# EAGLE design PAGE1 (EAGLE 9.6.0)

## Sheet 1 of 2
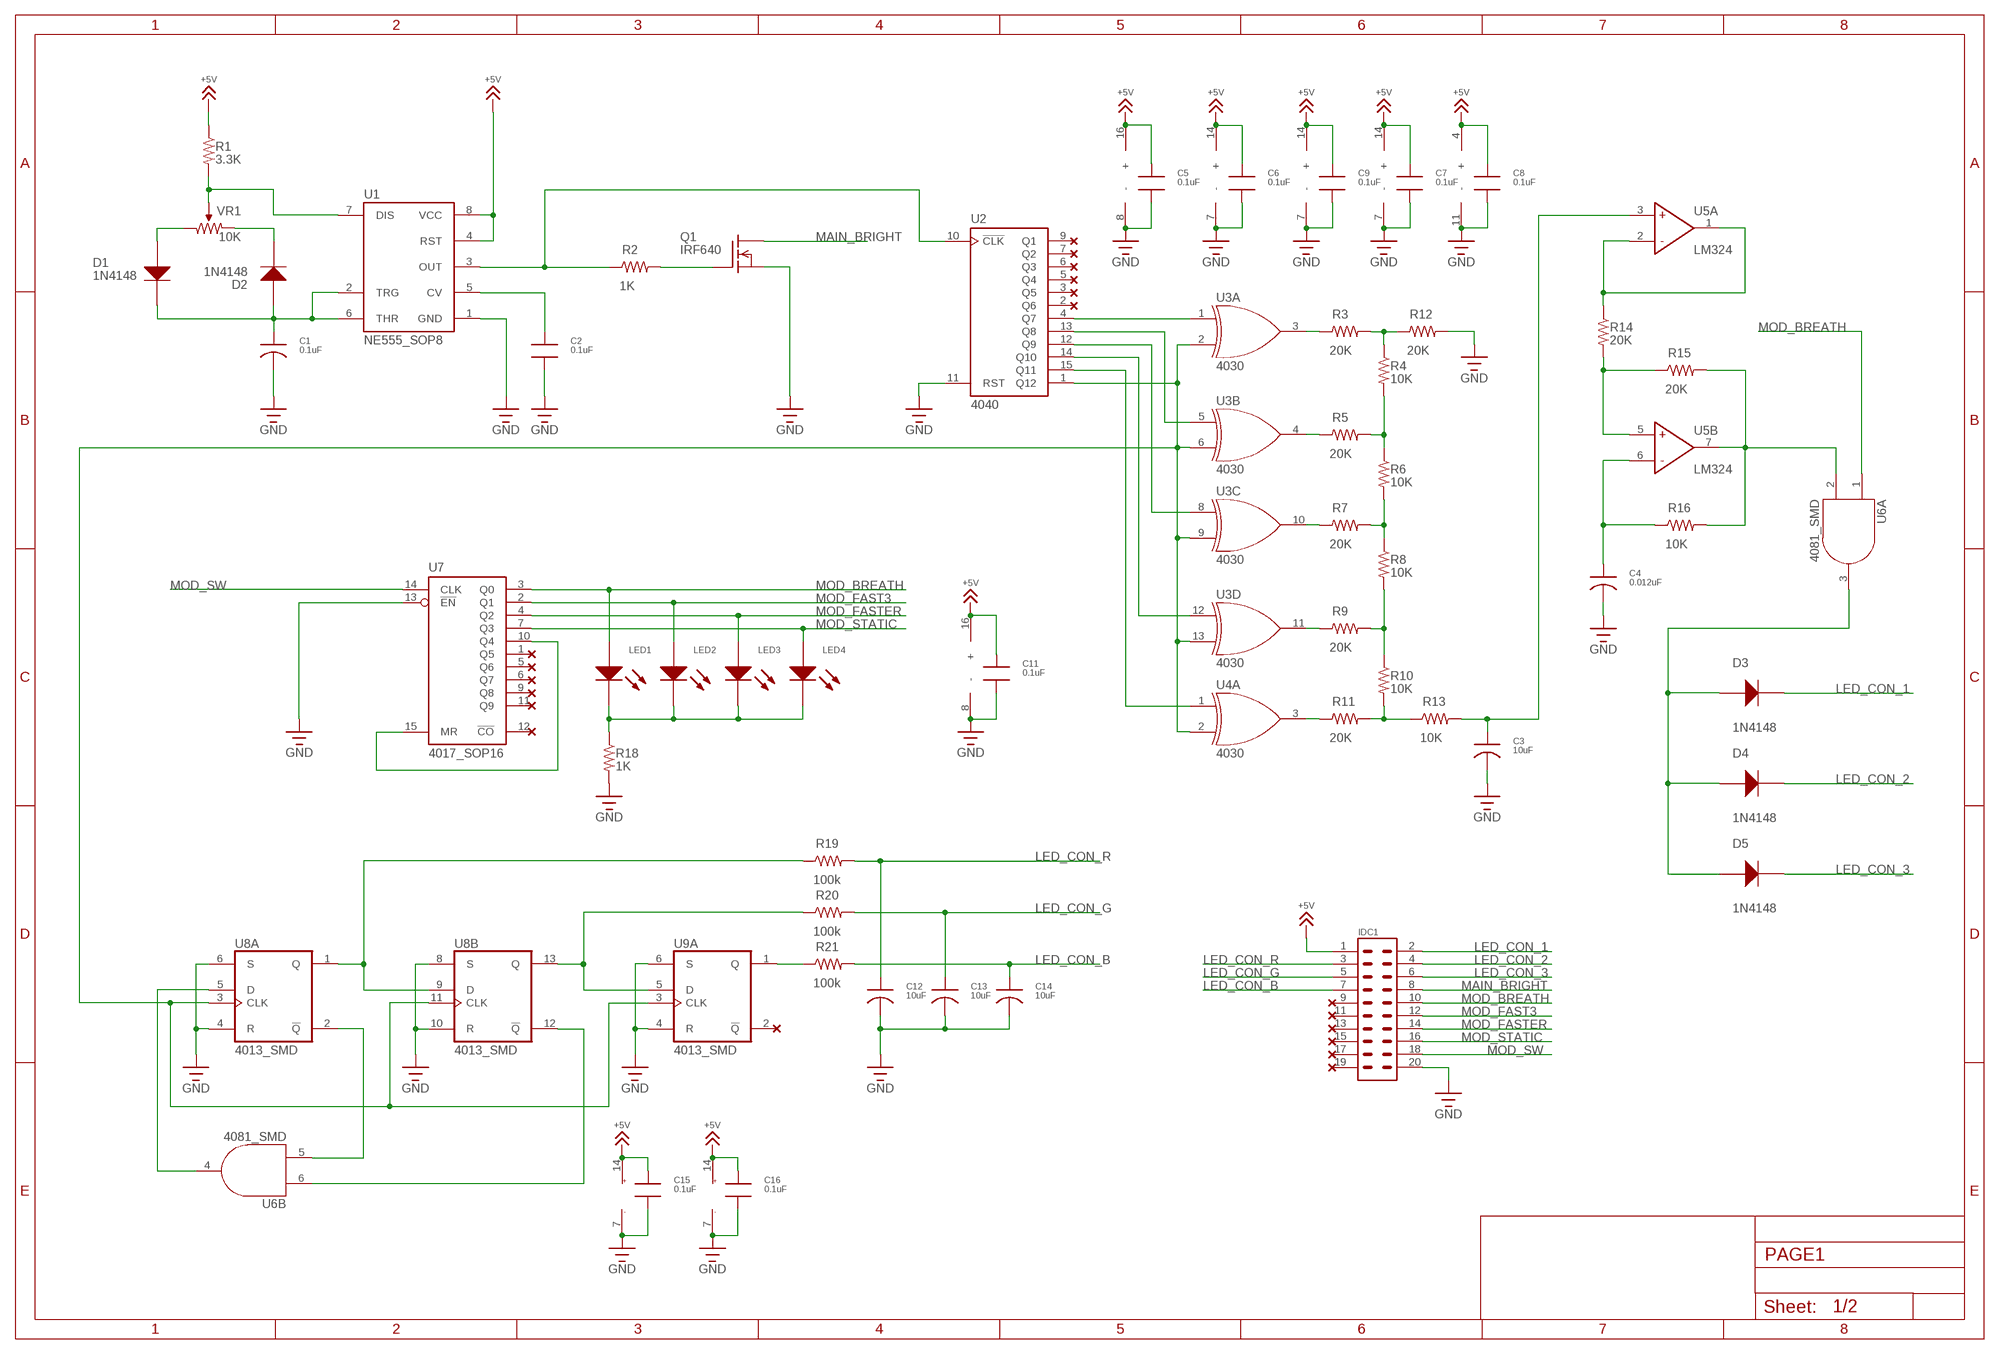
[diagram p0: schematic, sheet 1]

### Parts
C1  0.1uF  CAP_POL_NOR  [CAP_POL]
C2  0.1uF  CAP_NP_SMD2012  [SMD2012]
C3  10uF  CAP_POL_NOR  [CAP_POL]
C4  0.012uF  CAP_POL_NOR  [CAP_POL]
C5  0.1uF  CAP_NP_SMD2012  [SMD2012]
C6  0.1uF  CAP_NP_SMD2012  [SMD2012]
C7  0.1uF  CAP_NP_SMD2012  [SMD2012]
C8  0.1uF  CAP_NP_SMD2012  [SMD2012]
C9  0.1uF  CAP_NP_SMD2012  [SMD2012]
C11  0.1uF  CAP_NP_SMD2012  [SMD2012]
C12  10uF  CAP_POL_NOR  [CAP_POL]
C13  10uF  CAP_POL_NOR  [CAP_POL]
C14  10uF  CAP_POL_NOR  [CAP_POL]
C15  0.1uF  CAP_NP_SMD2012  [SMD2012]
C16  0.1uF  CAP_NP_SMD2012  [SMD2012]
D1  1N4148  DIODE_SMD  [SMD_DIODE]
D2  1N4148  DIODE_SMD  [SMD_DIODE]
D3  1N4148  DIODE_SMD  [SMD_DIODE]
D4  1N4148  DIODE_SMD  [SMD_DIODE]
D5  1N4148  DIODE_SMD  [SMD_DIODE]
IDC1  IDC20_BEN  [IDC20_BENDING]
LED1  LED_BEN  [LED_5MM_BEN]
LED2  LED_BEN  [LED_5MM_BEN]
LED3  LED_BEN  [LED_5MM_BEN]
LED4  LED_BEN  [LED_5MM_BEN]
Q1  IRF640  IRF620  [TO220]
R1  3.3K  RES_2012  [SMD2012]
R2  1K  RES_2012  [SMD2012]
R3  20K  RES_2012  [SMD2012]
R4  10K  RES_2012  [SMD2012]
R5  20K  RES_2012  [SMD2012]
R6  10K  RES_2012  [SMD2012]
R7  20K  RES_2012  [SMD2012]
R8  10K  RES_2012  [SMD2012]
R9  20K  RES_2012  [SMD2012]
R10  10K  RES_2012  [SMD2012]
R11  20K  RES_2012  [SMD2012]
R12  20K  RES_2012  [SMD2012]
R13  10K  RES_2012  [SMD2012]
R14  20K  RES_2012  [SMD2012]
R15  20K  RES_2012  [SMD2012]
R16  10K  RES_2012  [SMD2012]
R18  1K  RES_2012  [SMD2012]
R19  100k  RES_2012  [SMD2012]
R20  100k  RES_2012  [SMD2012]
R21  100k  RES_2012  [SMD2012]
U1  NE555_SOP8  [SOP8]
U2  4040  [DIP16]
U3  4030  [DIP14]
U4  4030  [DIP14]
U5  LM324  [DIP14]
U6  4081_SMD  [SOP14]
U7  4017_SOP16  [SOP16]
U8  4013_SMD  [SOIC_14]
U9  4013_SMD  [SOIC_14]
VR1  10K  VR_BIG  [3RP/1610N]

### Nets
+5V [POWER]: C5.1 C6.1 C7.1 C8.1 C9.1 C11.1 C15.1 C16.1 IDC1.1 R1.1 U1.4(RST) U1.8(VCC) U2.16(+) U3.14(+) U4.14(+) U5.4(+) U6.14(+) U7.16(+) U8.14(VCC) U9.14(VCC) ; also sheet 2
GND [POWER]: C1.2 C2.2 C3.2 C4.2 C5.2 C6.2 C7.2 C8.2 C9.2 C11.2 C12.2 C13.2 C14.2 C15.2 C16.2 IDC1.20 Q1.3(S) R12.2 R18.2 U1.1(GND) U2.8(-) U2.11(RST) U3.7(-) U4.7(-) U5.11(-) U6.7(-) U7.8(-) U7.13(!EN) U8.4(A:R) U8.6(A:S) U8.7(GND) U8.8(B:S) U8.10(B:R) U9.4(A:R) U9.6(A:S) U9.7(GND) ; also sheet 2
LED_CON_1: D3.2 IDC1.2 ; also sheet 2
LED_CON_2: D4.2 IDC1.4 ; also sheet 2
LED_CON_3: D5.2 IDC1.6 ; also sheet 2
LED_CON_B: C14.1 IDC1.7 R21.2
LED_CON_G: C13.1 IDC1.5 R20.2
LED_CON_R: C12.1 IDC1.3 R19.2
MAIN_BRIGHT: IDC1.8 Q1.2(D)
MOD_BREATH: IDC1.10 LED1.1 U6.1 U7.3(Q0)
MOD_FAST3: IDC1.12 LED2.1 U7.2(Q1) ; also sheet 2
MOD_FASTER: IDC1.14 LED3.1 U7.4(Q2) ; also sheet 2
MOD_STATIC: IDC1.16 LED4.1 U7.7(Q3) ; also sheet 2
MOD_SW: IDC1.18 U7.14(CLK)
N$1: D1.1 VR1.1
N$2: R1.2 U1.7(DIS) VR1.2
N$3: D2.2 VR1.3
N$4: C2.1 U1.5(CV)
N$5: C1.1 D1.2 D2.1 U1.2(TRG) U1.6(THR)
N$6: R2.1 U1.3(OUT) U2.10(!CLK)
N$7: Q1.1(G) R2.2
N$8: U2.4(Q7) U3.1(A:IN1)
N$9: U2.13(Q8) U3.5(B:IN1)
N$10: U2.12(Q9) U3.8(C:IN1)
N$11: U2.14(Q10) U3.12(D:IN1)
N$12: U2.15(Q11) U4.1(A:IN1)
N$14: R3.1 U3.3(A:OUT)
N$15: R5.1 U3.4(B:OUT)
N$16: R7.1 U3.10(C:OUT)
N$17: R9.1 U3.11(D:OUT)
N$18: R11.1 U4.3(A:OUT)
N$19: R3.2 R4.1 R12.1
N$20: R4.2 R5.2 R6.1
N$21: R6.2 R7.2 R8.1
N$22: R8.2 R9.2 R10.1
N$23: R10.2 R11.2 R13.1
N$24: C3.1 R13.2 U5.3(A:+)
N$25: R14.1 U5.1(A:OUT) U5.2(A:-)
N$26: R15.2 R16.2 U5.7(B:OUT) U6.2
N$27: R14.2 R15.1 U5.5(B:+)
N$28: C4.1 R16.1 U5.6(B:-)
N$29: D3.1 D4.1 D5.1 U6.3
N$32: U7.10(Q4) U7.15(MR)
N$33: LED1.2 LED2.2 LED3.2 LED4.2 R18.1
N$34: U6.5 U8.2(A:!Q)
N$35: U6.6 U8.12(B:!Q)
N$36: U6.4 U8.5(A:D)
N$37: R19.1 U8.1(A:Q) U8.9(B:D)
N$38: R20.1 U8.13(B:Q) U9.5(A:D)
N$39: U2.1(Q12) U3.2(A:IN2) U3.6(B:IN2) U3.9(C:IN2) U3.13(D:IN2) U4.2(A:IN2) U8.3(A:CLK) U8.11(B:CLK) U9.3(A:CLK)
N$40: R21.1 U9.1(A:Q)
Unconnected: IDC1.9 IDC1.11 IDC1.13 IDC1.15 IDC1.17 IDC1.19 U2.2(Q6) U2.3(Q5) U2.5(Q4) U2.6(Q3) U2.7(Q2) U2.9(Q1) U4.4(B:OUT) U4.5(B:IN1) U4.6(B:IN2) U4.8(C:IN1) U4.9(C:IN2) U4.10(C:OUT) U4.11(D:OUT) U4.12(D:IN1) U4.13(D:IN2) U5.8(C:OUT) U5.9(C:-) U5.10(C:+) U5.12(D:+) U5.13(D:-) U5.14(D:OUT) U6.8 U6.9 U6.10 U6.11 U6.12 U6.13 U7.1(Q5) U7.5(Q6) U7.6(Q7) U7.9(Q8) U7.11(Q9) U7.12(!CO) U9.2(A:!Q) U9.8(B:S) U9.9(B:D) U9.10(B:R) U9.11(B:CLK) U9.12(B:!Q) U9.13(B:Q)

## Sheet 2 of 2
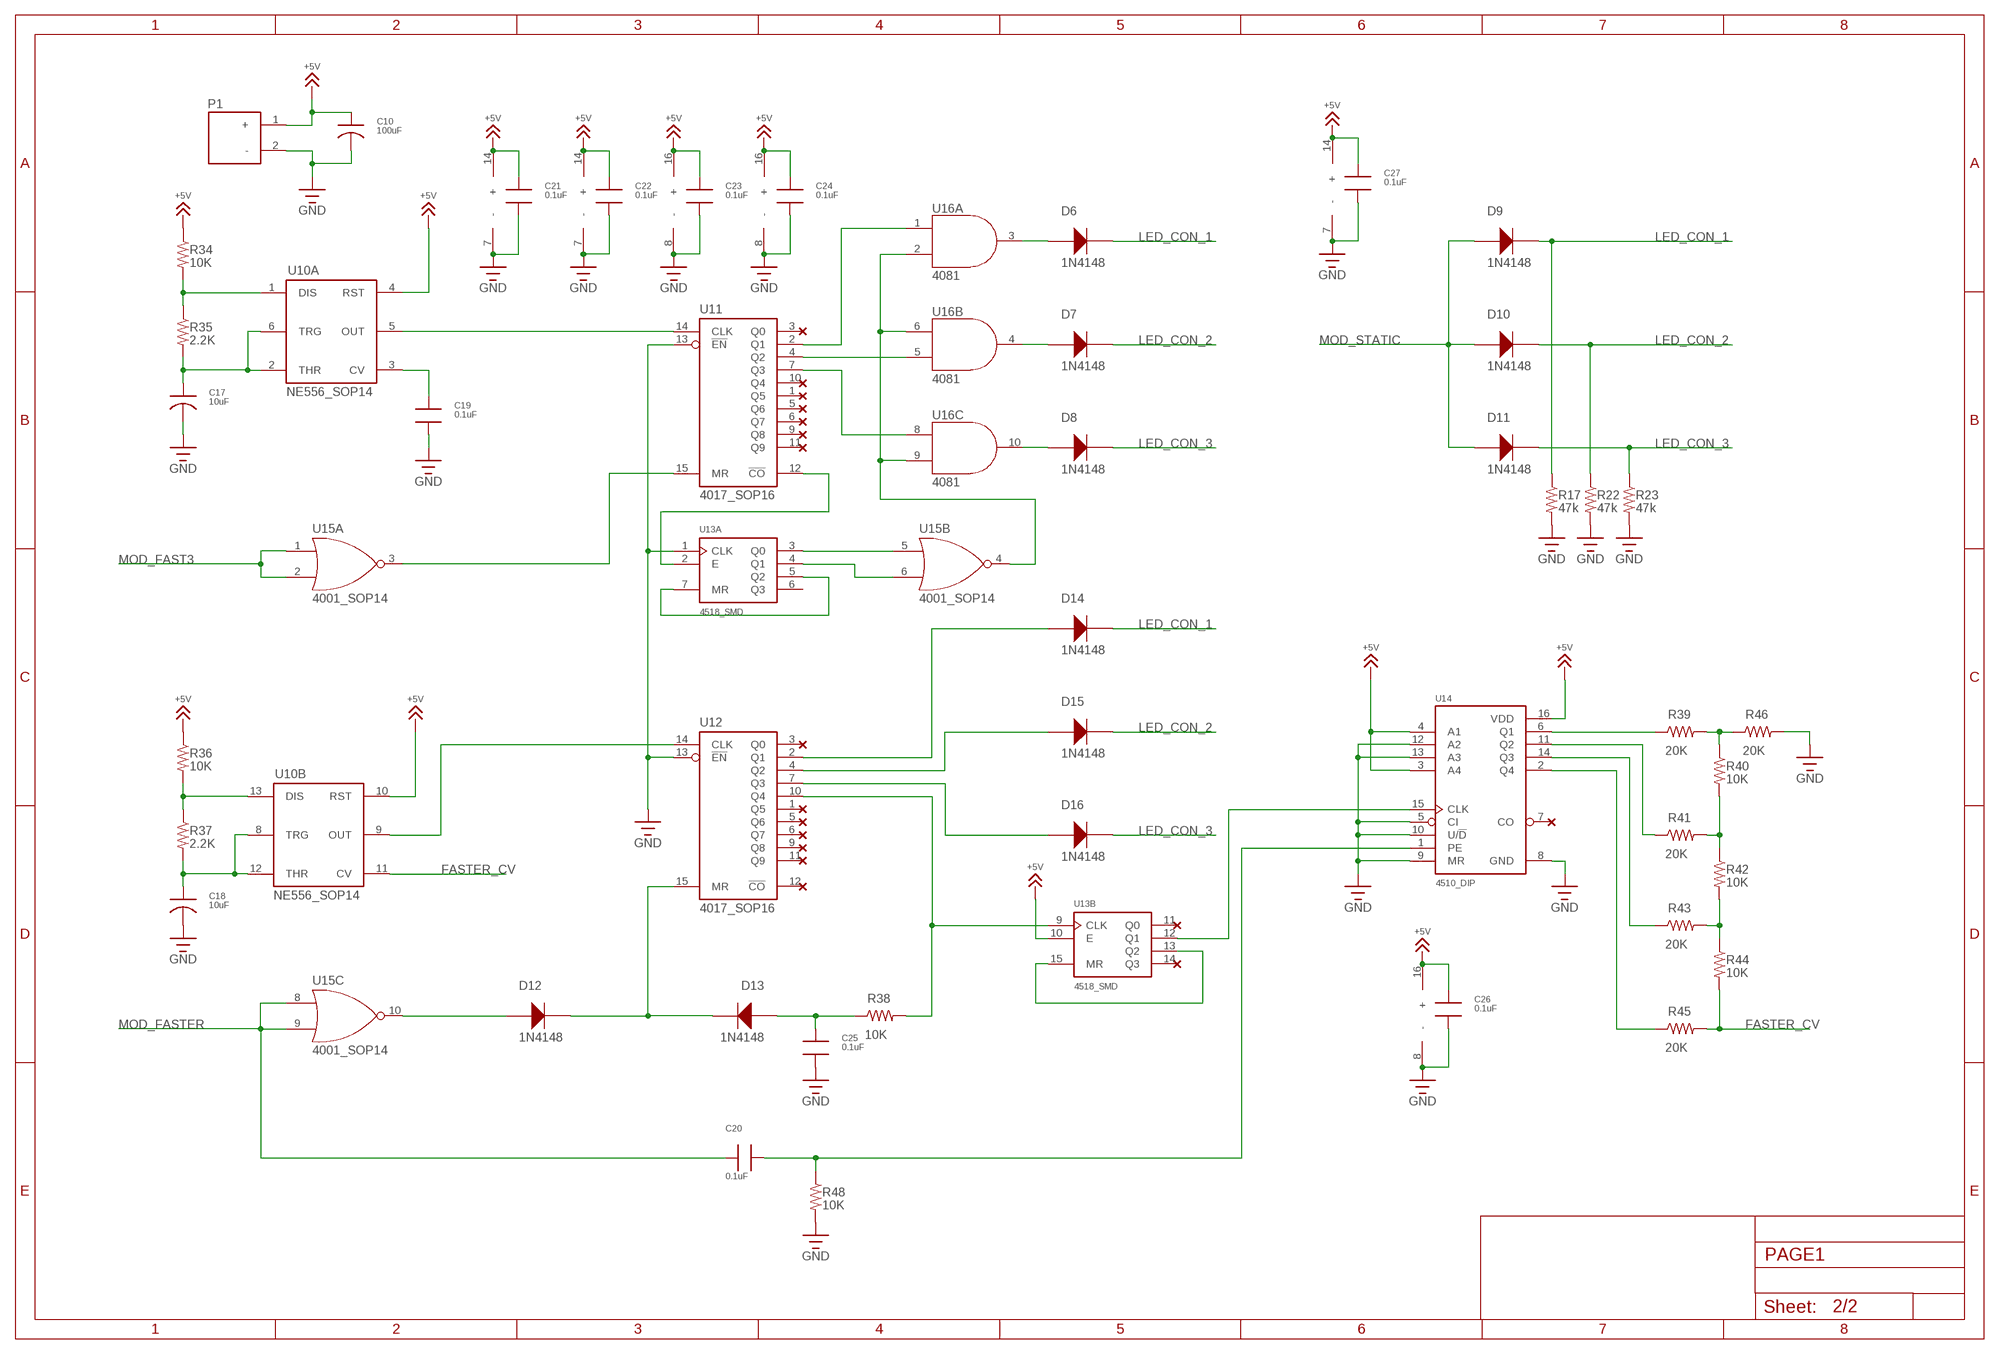
[diagram p1: schematic, sheet 2]

### Parts
C10  100uF  CAP_POL_BIG  [CAP_POL_BIG]
C17  10uF  CAP_POL_NOR  [CAP_POL]
C18  10uF  CAP_POL_NOR  [CAP_POL]
C19  0.1uF  CAP_NP_SMD2012  [SMD2012]
C20  0.1uF  CAP_NP_SMD2012  [SMD2012]
C21  0.1uF  CAP_NP_SMD2012  [SMD2012]
C22  0.1uF  CAP_NP_SMD2012  [SMD2012]
C23  0.1uF  CAP_NP_SMD2012  [SMD2012]
C24  0.1uF  CAP_NP_SMD2012  [SMD2012]
C25  0.1uF  CAP_NP_SMD2012  [SMD2012]
C26  0.1uF  CAP_NP_SMD2012  [SMD2012]
C27  0.1uF  CAP_NP_SMD2012  [SMD2012]
D6  1N4148  DIODE_SMD  [SMD_DIODE]
D7  1N4148  DIODE_SMD  [SMD_DIODE]
D8  1N4148  DIODE_SMD  [SMD_DIODE]
D9  1N4148  DIODE_SMD  [SMD_DIODE]
D10  1N4148  DIODE_SMD  [SMD_DIODE]
D11  1N4148  DIODE_SMD  [SMD_DIODE]
D12  1N4148  DIODE_SMD  [SMD_DIODE]
D13  1N4148  DIODE_SMD  [SMD_DIODE]
D14  1N4148  DIODE_SMD  [SMD_DIODE]
D15  1N4148  DIODE_SMD  [SMD_DIODE]
D16  1N4148  DIODE_SMD  [SMD_DIODE]
P1  POWER_2  [POWER_2]
R17  47k  RES_2012  [SMD2012]
R22  47k  RES_2012  [SMD2012]
R23  47k  RES_2012  [SMD2012]
R34  10K  RES_2012  [SMD2012]
R35  2.2K  RES_2012  [SMD2012]
R36  10K  RES_2012  [SMD2012]
R37  2.2K  RES_2012  [SMD2012]
R38  10K  RES_2012  [SMD2012]
R39  20K  RES_2012  [SMD2012]
R40  10K  RES_2012  [SMD2012]
R41  20K  RES_2012  [SMD2012]
R42  10K  RES_2012  [SMD2012]
R43  20K  RES_2012  [SMD2012]
R44  10K  RES_2012  [SMD2012]
R45  20K  RES_2012  [SMD2012]
R46  20K  RES_2012  [SMD2012]
R48  10K  RES_2012  [SMD2012]
U10  NE556_SOP14  [SOP14]
U11  4017_SOP16  [SOP16]
U12  4017_SOP16  [SOP16]
U13  4518_SMD  [SOP16]
U14  4510_DIP  [DIP16]
U15  4001_SOP14  [SOP14]
U16  4081  [DIP14]

### Nets
+5V [POWER]: C10.1 C21.1 C22.1 C23.1 C24.1 C26.1 C27.1 P1.1(+) R34.1 R36.1 U10.4(A:RST) U10.10(B:RST) U10.14(+) U11.16(+) U12.16(+) U13.10(B:E) U13.16(+) U14.3(A4) U14.4(A1) U14.16(VDD) U15.14(+) U16.14(+) ; also sheet 1
FASTER_CV: R44.2 R45.2 U10.11(B:CV)
GND [POWER]: C10.2 C17.2 C18.2 C19.2 C21.2 C22.2 C23.2 C24.2 C25.2 C26.2 C27.2 P1.2(-) R17.2 R22.2 R23.2 R46.2 R48.2 U10.7(-) U11.8(-) U11.13(!EN) U12.8(-) U12.13(!EN) U13.1(A:CLK) U13.8(-) U14.5(CI) U14.8(GND) U14.9(MR) U14.10(U/!D) U14.12(A2) U14.13(A3) U15.7(-) U16.7(-) ; also sheet 1
LED_CON_1: D6.2 D9.2 D14.2 R17.1 ; also sheet 1
LED_CON_2: D7.2 D10.2 D15.2 R22.1 ; also sheet 1
LED_CON_3: D8.2 D11.2 D16.2 R23.1 ; also sheet 1
MOD_FAST3: U15.1(A:IN1) U15.2(A:IN2) ; also sheet 1
MOD_FASTER: C20.1 U15.8(C:IN1) U15.9(C:IN2) ; also sheet 1
MOD_STATIC: D9.1 D10.1 D11.1 ; also sheet 1
N$58: C17.1 R35.2 U10.2(A:THR) U10.6(A:TRG)
N$59: R34.2 R35.1 U10.1(A:DIS)
N$60: U10.5(A:OUT) U11.14(CLK)
N$61: C19.1 U10.3(A:CV)
N$62: U13.5(A:Q2) U13.7(A:MR)
N$63: U11.12(!CO) U13.2(A:E)
N$64: U11.15(MR) U15.3(A:OUT)
N$65: U13.3(A:Q0) U15.5(B:IN1)
N$66: U13.4(A:Q1) U15.6(B:IN2)
N$67: U11.2(Q1) U16.1
N$68: U11.4(Q2) U16.5
N$69: U11.7(Q3) U16.8
N$70: U15.4(B:OUT) U16.2 U16.6 U16.9
N$71: D6.1 U16.3
N$72: D7.1 U16.4
N$73: D8.1 U16.10
N$74: R36.2 R37.1 U10.13(B:DIS)
N$75: C18.1 R37.2 U10.8(B:TRG) U10.12(B:THR)
N$76: C20.2 R48.1 U14.1(PE)
N$77: U10.9(B:OUT) U12.14(CLK)
N$78: D12.2 D13.2 U12.15(MR)
N$79: R39.1 U14.6(Q1)
N$80: D12.1 U15.10(C:OUT)
N$81: D14.1 U12.2(Q1)
N$82: D15.1 U12.4(Q2)
N$83: D16.1 U12.7(Q3)
N$84: C25.1 D13.1 R38.1
N$85: U13.13(B:Q2) U13.15(B:MR)
N$86: R38.2 U12.10(Q4) U13.9(B:CLK)
N$87: R41.1 U14.11(Q2)
N$88: R43.1 U14.14(Q3)
N$89: U13.12(B:Q1) U14.15(CLK)
N$90: R45.1 U14.2(Q4)
N$91: R39.2 R40.1 R46.1
N$92: R40.2 R41.2 R42.1
N$93: R42.2 R43.2 R44.1
Unconnected: U11.1(Q5) U11.3(Q0) U11.5(Q6) U11.6(Q7) U11.9(Q8) U11.10(Q4) U11.11(Q9) U12.1(Q5) U12.3(Q0) U12.5(Q6) U12.6(Q7) U12.9(Q8) U12.11(Q9) U12.12(!CO) U13.6(A:Q3) U13.11(B:Q0) U13.14(B:Q3) U14.7(CO) U15.11(D:OUT) U15.12(D:IN1) U15.13(D:IN2) U16.11 U16.12 U16.13

## Library data of the parts
C1 C3 C4 C10 C12-C14 C17 C18 = !JKS:CAP_POL
C2 C5-C9 C11 C15 C16 C19-C27 = !JKS:CAP_NP
D1-D16 = !JKS:DIODE
IDC1 = !JKS:IDC20
LED1-LED4 = !JKS:LED
P1 = !JKS:POWER_2
Q1 = transistor-fet:IRF620: N-Channel Enhancement MOSFET (HEXFET); 200V; 5,2A; 0,8Ohm
R1-R23 R34-R46 R48 = !JKS:RES
U1 = !JKS:NE555
U2 = !JKS:4040
U3 U4 = !JKS:4030
U5 = !JKS:LM324
U6 U16 = !JKS:4081
U7 U11 U12 = !JKS:4017
U8 U9 = !SEM_03:4013: Dual D-Type Flip-Flop
U10 = !JKS:NE556
U13 = !JKS:4518
U14 = !JKS:4510
U15 = !JKS:4001
VR1 = !JKS:VR

## Net classes
0 default: width 0.254 mm
1 POWER: width 0.3 mm

## Board
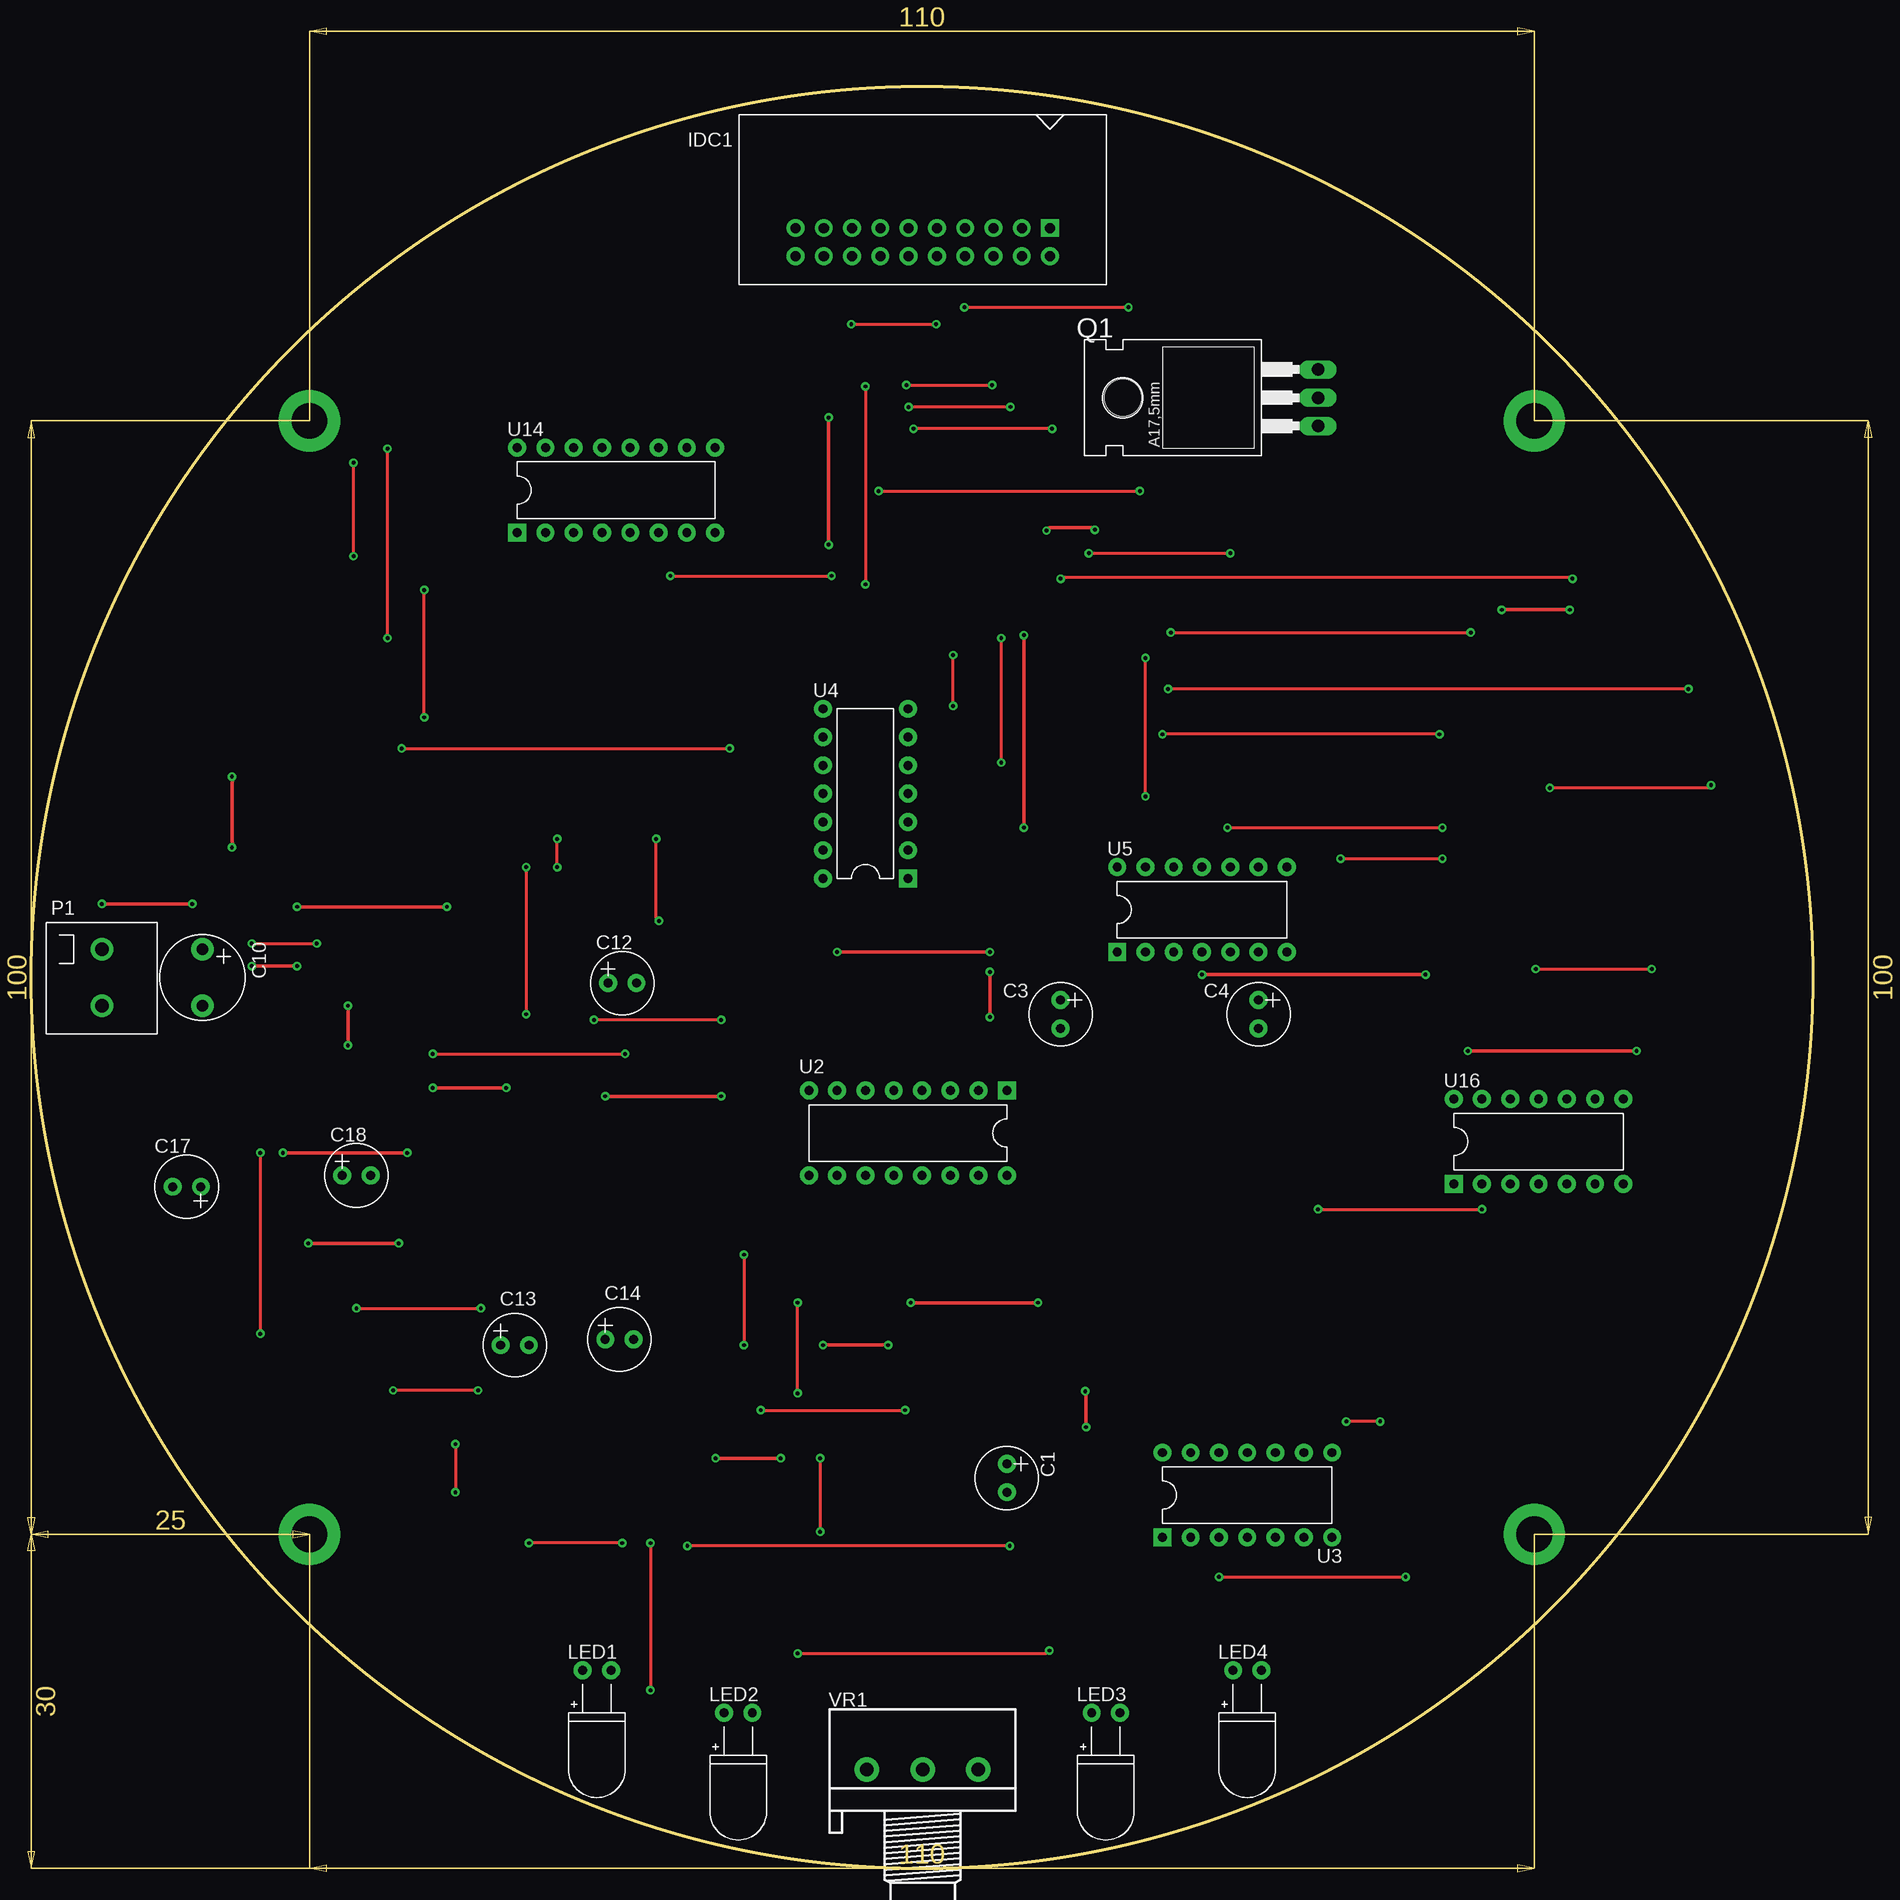
[diagram p2: board, top side]
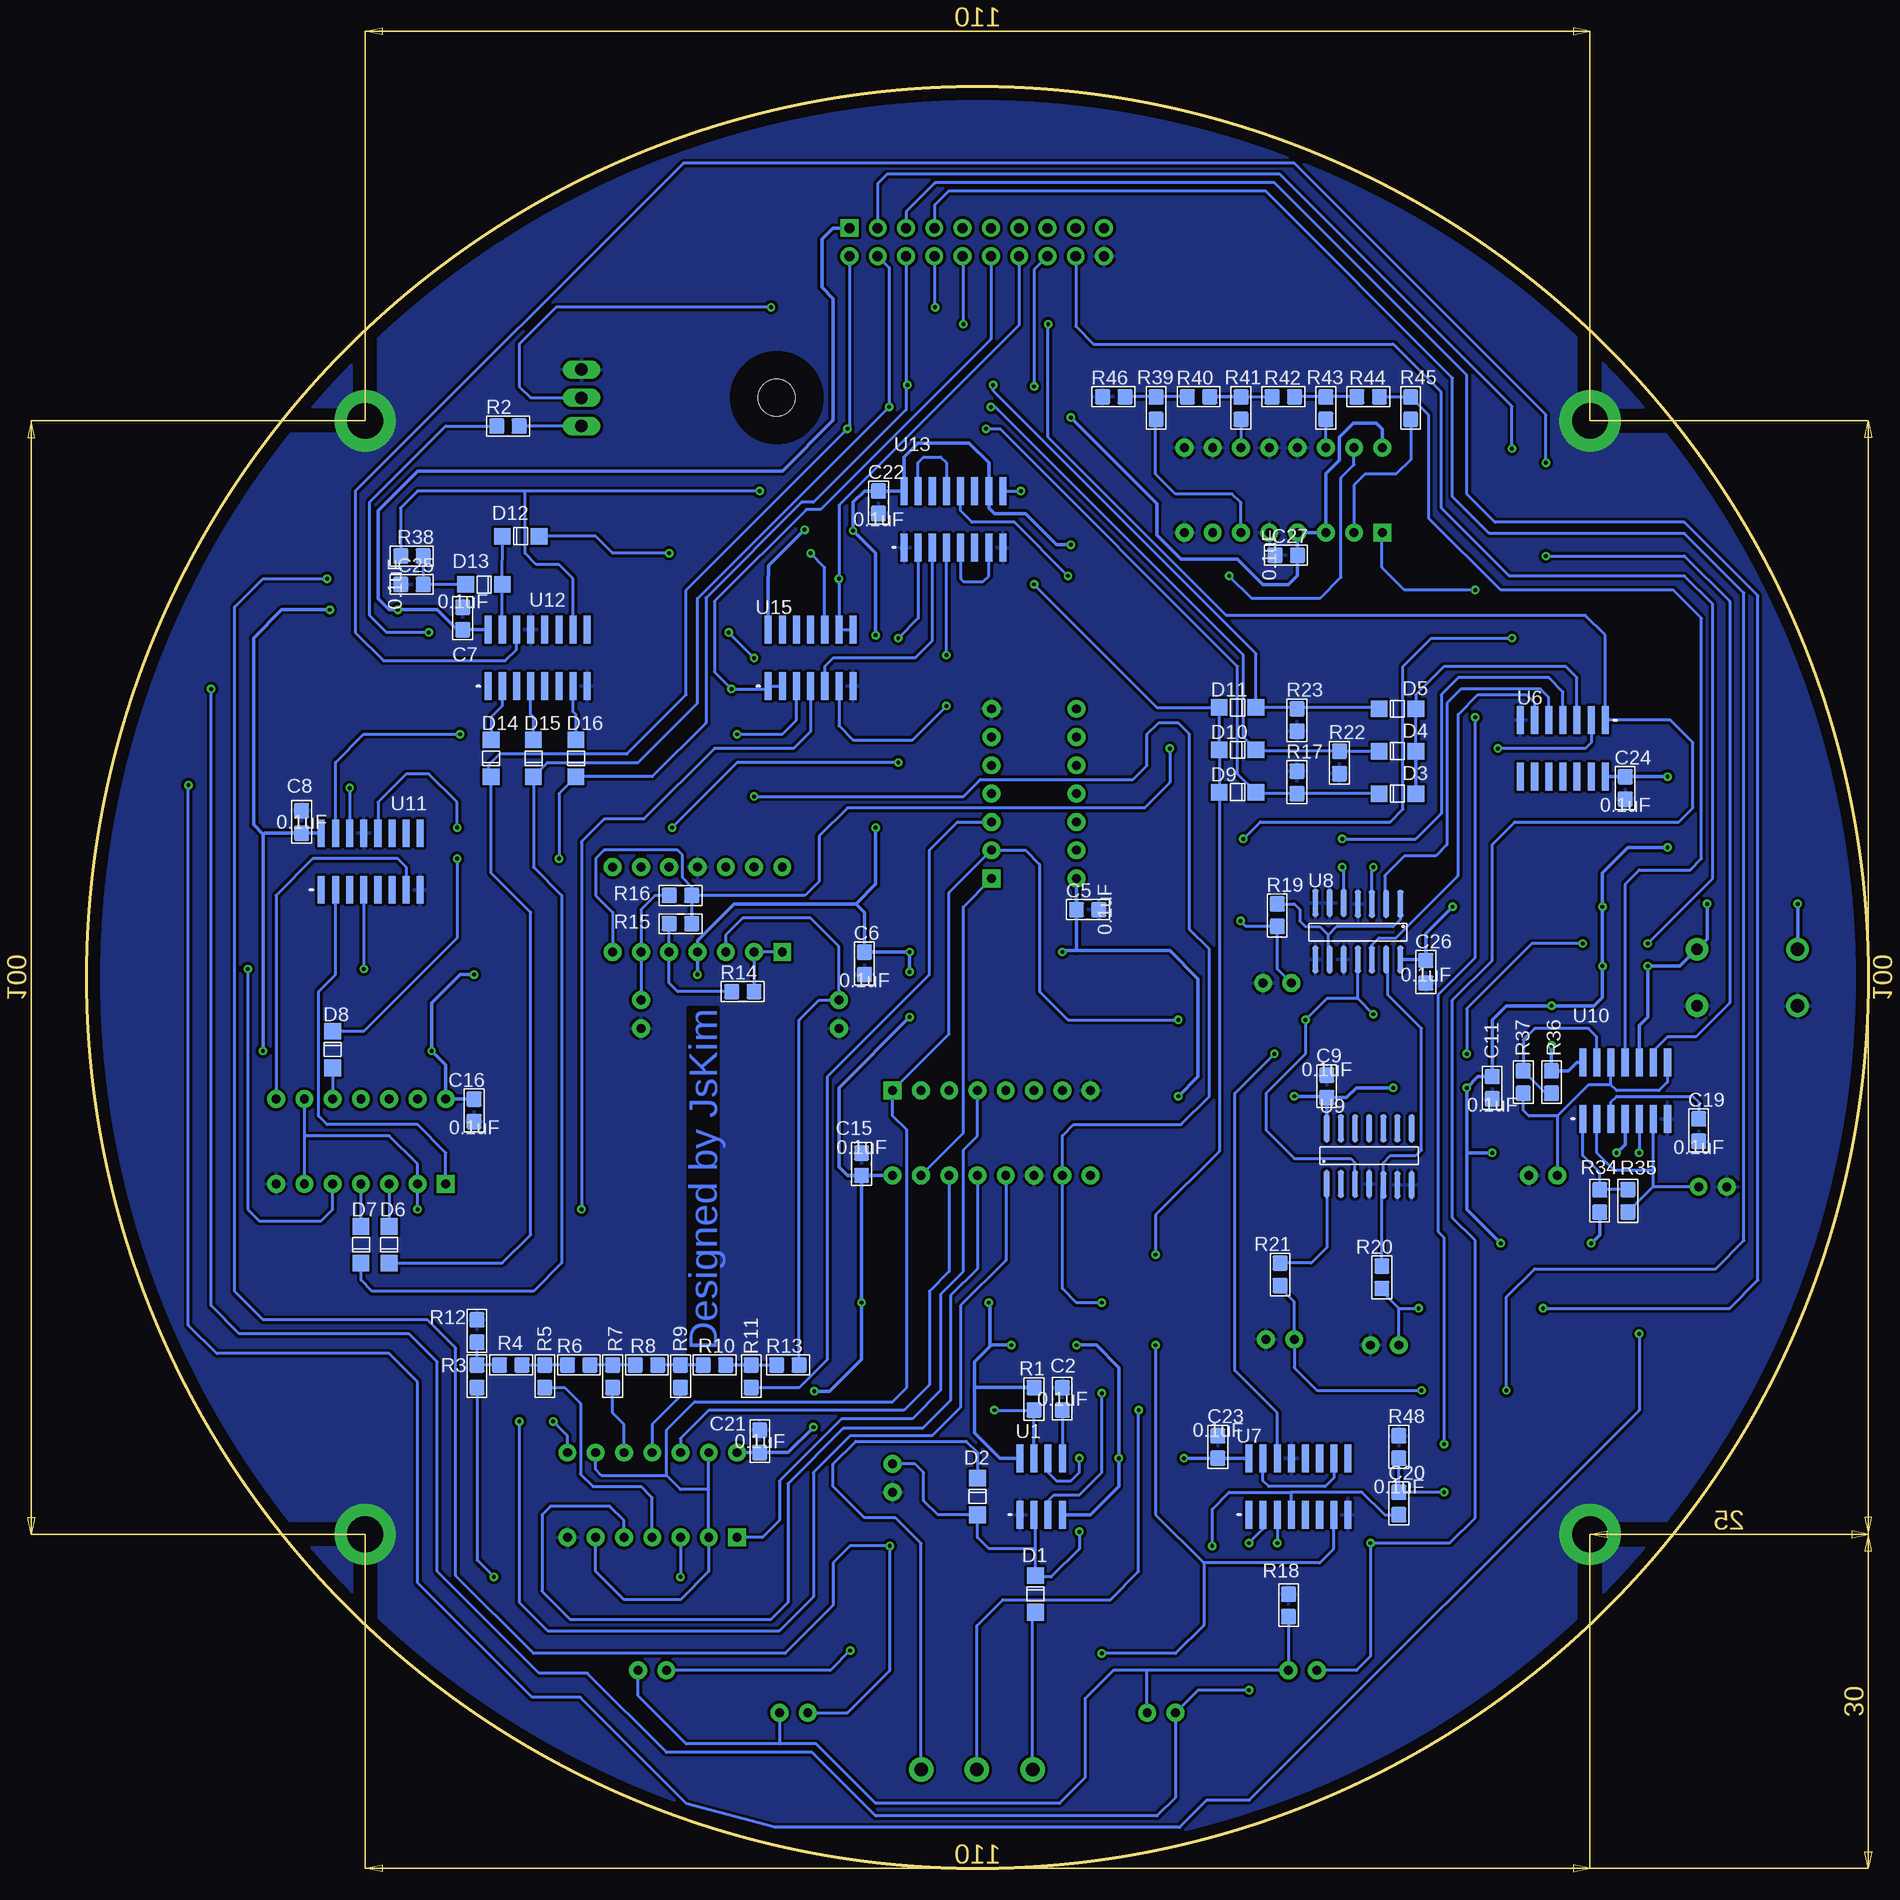
[diagram p3: board, bottom side, seen from below]

Size 160 x 160 mm. Coordinates in mm from the lower left corner, seen from the top.
Outline: circle at 80,80 radius 80
Copper layers (1*16): Top 0.035mm / dielectric 0.15mm / Bottom 0.035mm
Design rules "default *": minimum track width 10mil, minimum drill 0.35mm, track to track 10mil, track to pad 10mil, pad to pad 6mil, via to via 10mil, smd to smd 10mil, copper to edge 40mil, drill to drill 6mil, minimum pad ring 10mil, minimum via ring 8mil, stop-mask expansion 4mil, vias tented up to drill 0mil, thermal gap 10mil

### Footprints (pad centres in the part's own frame; a part is rotated, then mirrored left to right if it is on the bottom)
CAP_POL = drill 0.8 pad 1.6: 1 0,0; 2 2.54,0
SMD2012 = smd 1.4 x 1.4: 1 0,0; 2 2.019,0
CAP_POL_BIG = drill 1 pad 2: 1 0,0; 2 5.08,0
SMD_DIODE = smd 1.5 x 1.5: 1 0,0; 2 3.3,0
IDC20_BENDING = drill 0.9 pad 1.6 square: 1 0,0 | drill 0.9 pad 1.6: 2 2.54,0; 3 0,-2.54; 4 2.54,-2.54; 5 0,-5.08; 6 2.54,-5.08; 7 0,-7.62; 8 2.54,-7.62; 9 0,-10.16; 10 2.54,-10.16; 11 0,-12.7; 12 2.54,-12.7; 13 0,-15.24; 14 2.54,-15.24; 15 0,-17.78; 16 2.54,-17.78; 17 0,-20.32; 18 2.54,-20.32; 19 0,-22.86; 20 2.54,-22.86
LED_5MM_BEN = drill 0.8 pad 1.6: 1 0,0; 2 0,-2.54
POWER_2 = drill 1.2 pad 2: 1 0,0; 2 0,-5.08
TO220 = drill 1.118 long: 1 -2.54,-6.35; 2 0,-6.35; 3 2.54,-6.35 | hole 3.302: 0,11.176
SOP8 = smd 0.635 x 2.5: 1 0,0; 2 1.27,0; 3 2.54,0; 4 3.81,0; 5 3.81,5.08; 6 2.54,5.08; 7 1.27,5.08; 8 0,5.08
DIP16 = drill 0.8 pad 1.6 square: 1 0,0 | drill 0.8 pad 1.6: 2 2.54,0; 3 5.08,0; 4 7.62,0; 5 10.16,0; 6 12.7,0; 7 15.24,0; 8 17.78,0; 9 17.78,7.62; 10 15.24,7.62; 11 12.7,7.62; 12 10.16,7.62; 13 7.62,7.62; 14 5.08,7.62; 15 2.54,7.62; 16 0,7.62
DIP14 = drill 0.8 pad 1.6 square: 1 0,0 | drill 0.8 pad 1.6: 2 2.54,0; 3 5.08,0; 4 7.62,0; 5 10.16,0; 6 12.7,0; 7 15.24,0; 8 15.24,7.62; 9 12.7,7.62; 10 10.16,7.62; 11 7.62,7.62; 12 5.08,7.62; 13 2.54,7.62; 14 0,7.62
SOP14 = smd 0.635 x 2.5: 1 0,0; 2 1.27,0; 3 2.54,0; 4 3.81,0; 5 5.08,0; 6 6.35,0; 7 7.62,0; 8 7.62,5.08; 9 6.35,5.08; 10 5.08,5.08; 11 3.81,5.08; 12 2.54,5.08; 13 1.27,5.08; 14 0,5.08
SOP16 = smd 0.635 x 2.5: 1 0,0; 2 1.27,0; 3 2.54,0; 4 3.81,0; 5 5.08,0; 6 6.35,0; 7 7.62,0; 8 8.89,0; 9 8.89,5.08; 10 7.62,5.08; 11 6.35,5.08; 12 5.08,5.08; 13 3.81,5.08; 14 2.54,5.08; 15 1.27,5.08; 16 0,5.08
SOIC_14 = smd 0.55 x 2.5: 1 -3.175,-2.54; 2 -1.905,-2.54; 3 -0.635,-2.54; 4 0.635,-2.54; 5 1.905,-2.63; 6 3.175,-2.63; 7 4.445,-2.63; 8 4.445,2.45; 9 3.175,2.45; 10 1.905,2.45; 11 0.635,2.45; 12 -0.635,2.45; 13 -1.905,2.45; 14 -3.175,2.45
3RP/1610N = drill 1.2 pad 2.184: 1 -5,0; 2 0,0; 3 5,0

### Placement (x,y rotation side)
C1  87.63,36.32 270 top
C2  72.39,41.15 90 bottom
C3  92.46,77.98 270 top
C4  110.24,77.98 270 top
C5  71.12,86.11 0 bottom
C6  90.17,82.3 270 bottom
C7  126.24,111.25 90 bottom
C8  140.72,92.96 90 bottom
C9  48.64,69.22 90 bottom
C10  15.39,82.55 270 top
C11  33.78,71.12 270 bottom
C12  51.82,79.5 0 top
C13  42.16,46.99 0 top
C14  51.56,47.5 0 top
C15  90.42,62.23 90 bottom
C16  125.22,69.09 270 bottom
C17  15.24,61.21 180 top
C18  27.94,62.23 0 top
C19  15.24,67.31 270 bottom
C20  42.16,31.75 90 bottom
C21  99.57,37.34 90 bottom
C22  88.9,123.7 270 bottom
C23  58.42,36.83 90 bottom
C24  21.84,98.04 270 bottom
C25  129.79,115.32 180 bottom
C26  39.75,81.53 270 bottom
C27  51.27,117.94 180 bottom
D1  74.8,22.99 90 bottom
D2  80.01,31.75 90 bottom
D3  40.64,96.52 180 bottom
D4  40.64,100.33 180 bottom
D5  40.64,104.14 180 bottom
D6  132.84,57.66 270 bottom
D7  135.38,57.66 270 bottom
D8  137.92,71.88 90 bottom
D9  58.29,96.65 0 bottom
D10  58.29,100.46 0 bottom
D11  58.29,104.27 0 bottom
D12  119.38,119.63 180 bottom
D13  125.98,115.32 0 bottom
D14  123.7,101.35 270 bottom
D15  119.89,101.35 270 bottom
D16  116.08,101.35 270 bottom
IDC1  91.51,147.32 270 top
LED1  49.53,17.78 90 top
LED2  62.23,13.97 90 top
LED3  95.25,13.97 90 top
LED4  107.95,17.78 90 top
P1  6.35,82.55 0 top
Q1  109.22,132.08 90 top
R1  74.93,43.18 270 bottom
R2  123.19,129.54 0 bottom
R3  124.97,43.18 90 bottom
R4  122.94,45.21 0 bottom
R5  118.87,43.18 90 bottom
R6  116.84,45.21 0 bottom
R7  112.78,43.18 90 bottom
R8  110.74,45.21 0 bottom
R9  106.68,43.18 90 bottom
R10  104.65,45.21 0 bottom
R11  100.33,43.18 90 bottom
R12  124.97,47.24 90 bottom
R13  98.04,45.21 0 bottom
R14  100.08,78.74 180 bottom
R15  107.7,84.84 0 bottom
R16  107.7,87.38 0 bottom
R17  51.31,96.52 90 bottom
R18  52.07,22.61 90 bottom
R19  53.09,86.61 270 bottom
R20  43.69,54.1 270 bottom
R21  52.83,54.36 270 bottom
R22  47.5,100.33 270 bottom
R23  51.31,104.14 270 bottom
R34  24.13,58.93 90 bottom
R35  21.59,60.96 270 bottom
R36  28.45,71.63 270 bottom
R37  30.99,71.63 270 bottom
R38  129.79,117.86 180 bottom
R39  63.97,130.13 90 bottom
R40  61.17,132.16 0 bottom
R41  56.35,130.13 90 bottom
R42  53.55,132.16 0 bottom
R43  48.73,130.13 90 bottom
R44  45.93,132.16 0 bottom
R45  41.11,130.13 90 bottom
R46  66.76,132.16 180 bottom
R48  42.16,36.83 90 bottom
U1  76.2,31.75 0 bottom
U2  87.63,69.85 180 top
U3  101.6,29.72 0 top
U4  78.74,88.9 90 top
U5  97.54,82.3 0 top
U6  23.62,103.12 180 bottom
U7  55.63,31.75 0 bottom
U8  45.21,84.07 180 bottom
U9  45.47,64.01 0 bottom
U10  25.65,67.31 0 bottom
U11  138.94,87.88 0 bottom
U12  123.95,106.17 0 bottom
U13  86.61,118.62 0 bottom
U14  43.65,119.97 0 top
U15  98.81,106.17 0 bottom
U16  127.76,61.47 0 top
VR1  80.06,8.89 0 top

### Tracks (layer width: path | path; a pad name or v marks a point on that pad's centre or on a via)
+5V  (via drill 0.35 pad 0.7)
  Top 0.3: v28.45,73.91 v28.45,77.47 | v18.03,91.69 v18.03,98.04 | v71.63,130.3 v71.63,118.87 | v78.99,50.8 v90.42,50.8 | v72.39,82.3 v86.11,82.3 | v132.08,113.03 v138.18,113.03 | v129.03,73.41 v144.18,73.41 | v105.16,80.26 v125.22,80.26 | v94.74,39.62 94.74,42.78 v94.67,42.85 | v61.47,36.83 v67.31,36.83 | v42.67,70.1 v36.07,70.1 | v23.88,81.03 v19.81,81.03 | v14.48,86.61 v6.35,86.61 | v22.61,64.26 v33.78,64.26 | v37.34,86.36 v23.88,86.36 | v51.56,69.34 v61.98,69.34 | v86.11,76.45 v86.11,80.52 | v95.54,120.22 95.36,120.4 91.44,120.4 v91.19,120.14 | v89.15,110.74 v89.15,93.47 | v71.12,46.99 v76.96,46.99 | v24.89,56.13 v33.02,56.13
  Bottom 0.3: C9.1 U9.14 | U2.16 C15.1 | U1.8 77.98,36.83 80.26,39.12 80.26,43.18 | 80.26,43.18 R1.1 | U1.4 69.85,31.75 67.31,34.29 v67.31,36.83 67.31,44.96 69.34,46.99 v71.12,46.99 | 80.26,43.18 80.26,45.47 78.87,46.86 | U7.16 C23.1 v61.47,36.83 | U10.14 26.16,72.39 26.92,71.63 R36.1 v28.45,73.91 | U6.14 C24.1 v18.03,98.04 | v18.03,91.69 21.59,91.69 23.88,89.41 v23.88,86.36 v23.88,81.03 23.88,78.23 24.64,77.47 v28.45,77.47 32.51,77.47 33.78,76.2 C11.1 35.05,71.12 v36.07,70.1 36.07,64.26 | U14.16 43.65,129.25 44.2,129.79 46.23,129.79 47.5,128.52 47.5,126.49 48.73,125.26 U14.3 U14.4 C27.1 | C27.1 | C27.1 51.27,116.12 52.07,115.32 54.36,115.32 56.64,117.6 61.72,117.6 63.88,119.76 63.88,122.56 v71.63,130.3 | v71.63,118.87 72.9,118.87 75.69,121.67 78.49,121.67 78.99,122.17 U13.10 78.99,126.24 80.77,128.02 85.34,128.02 86.61,126.75 U13.16 C22.1 90.17,123.7 91.19,122.68 v91.19,120.14 89.15,118.11 v89.15,110.74 | U12.16 C7.1 126.75,111.25 128.52,113.03 v132.08,113.03 132.84,113.03 133.86,114.05 133.86,121.92 130.3,125.48 97.54,125.48 92.96,130.05 92.96,140.97 93.98,141.99 93.98,146.3 92.96,147.32 IDC1.1 | U11.16 C8.1 144.02,92.96 144.15,92.84 | U3.14 C21.1 97.03,37.34 v94.74,39.62 | 78.87,46.86 78.87,50.67 v78.99,50.8 | C15.1 v90.42,50.8 90.42,45.72 93.29,42.85 v94.67,42.85 | 90.93,86.61 90.17,85.85 C6.1 v86.11,82.3 v86.11,80.52 | 90.93,86.61 101.85,86.61 105.16,83.31 U5.4 v105.16,80.26 | U4.14 C5.1 71.12,82.42 | v72.39,82.3 72.26,82.42 71.12,82.42 | U8.14 39.84,81.62 C26.1 39.75,83.95 v37.34,86.36 | v138.18,113.03 142.49,113.03 145.03,110.49 145.03,93.73 144.15,92.84
  Bottom 0.3: C16.1 U16.14 127.76,72.14 v129.03,73.41 129.03,77.72 126.49,80.26 v125.22,80.26 | v144.18,73.41 144.15,73.44 144.15,92.84 | v33.02,56.13 36.07,59.18 36.07,64.26 | C9.1 46.86,69.22 45.97,70.1 v42.67,70.1 | U10.10 20.57,75.69 19.81,76.45 v19.81,81.03 16.91,81.03 C10.1 14.48,83.46 v14.48,86.61 | v6.35,86.61 P1.1 | U10.4 21.84,65.02 v22.61,64.26 | v33.78,64.26 36.07,64.26 | C9.1 48.77,69.34 v51.56,69.34 | v61.98,69.34 60.2,71.12 60.2,79.88 62.74,82.42 71.12,82.42 | C15.1 91.69,62.23 92.46,62.99 92.46,70.1 v86.11,76.45 | U15.14 98.81,116 98.77,116.04 98.77,116.98 v95.54,120.22 | v89.15,93.47 89.15,88.39 90.93,86.61 | v76.96,46.99 78.74,46.99 78.87,46.86 | R34.1 24.13,56.9 v24.89,56.13
FASTER_CV
  Bottom 0.254: R44.2 R45.2 39.5,130.54 39.5,121.28 33.02,114.81 17.53,114.81 14.99,112.27 14.99,90.68 16,89.66 20.57,89.66 21.84,88.39 U10.11
GND  (via drill 3.2 pad 5.5)
  other vias: 25,130 135,130 25,30 135,30
  pour Bottom: 0,80 arc-90 80,160 arc-90 160,80 arc-90 80,0 arc-90
LED_CON_1  (via drill 0.35 pad 0.7)
  Top 0.254: v91.69,129.29 v79.25,129.29
  Bottom 0.254: D3.2 R17.1 54.87,96.52 D9.2 56.64,98.3 56.64,107.95 77.98,129.29 v79.25,129.29 | IDC1.2 91.51,129.47 v91.69,129.29 106.17,114.81 106.17,105.41 111.51,100.08 122.94,100.08 123.95,99.06 123.95,98.3 D14.2 123.7,89.41 120.14,85.85 120.14,56.9 122.68,54.36 D6.2
LED_CON_2  (via drill 0.35 pad 0.7)
  Top 0.254: v87.95,131.25 78.82,131.25 v78.81,131.25
  Bottom 0.254: IDC1.4 87.95,143.76 v87.95,131.25 105.16,114.05 105.16,104.65 110.49,99.31 118.62,99.31 D15.2 119.89,89.92 117.35,87.38 117.35,54.36 119.89,51.82 134.37,51.82 135.38,52.83 D7.2 | v78.81,131.25 78.41,131.25 56.13,108.97 56.13,101.6 D10.2 54.87,100.33 R22.1 44.45,100.33 D4.2
LED_CON_3  (via drill 0.35 pad 0.7)
  Top 0.254: v78.61,133.22 v86.3,133.22 | v117.6,90.68 v126.75,90.68
  Bottom 0.254: D5.2 44.07,104.27 51.44,104.27 | 51.44,104.27 D11.2 54.99,109.09 78.61,132.72 v78.61,133.22 | IDC1.6 86.43,133.1 | 86.43,133.1 86.43,131 94.74,122.68 95.8,122.68 104.39,114.09 104.39,102.87 109.22,98.04 D16.2 117.6,96.52 v117.6,90.68 | v86.3,133.22 86.43,133.1 | v126.75,90.68 126.75,83.57 135.13,75.18 D8.2 | R23.1 51.44,104.27
LED_CON_B  (via drill 0.35 pad 0.7)
  Top 0.254: v40.13,42.93 v32.51,42.93
  Bottom 0.254: R21.2 52.77,52.09 51.56,50.88 C14.1 51.56,44.96 49.53,42.93 v40.13,42.93 | v32.51,42.93 32.51,51.31 29.97,53.85 13.72,53.85 11.18,56.39 11.18,114.55 16.51,119.89 34.04,119.89 37.34,123.19 37.34,133.86 54.1,150.62 82.62,150.62 83.89,149.35 IDC1.7
LED_CON_G  (via drill 0.35 pad 0.7)
  Top 0.254: v29.21,50.29 v40.39,50.29
  Bottom 0.254: R20.2 43.69,51.82 42.16,50.29 | C13.1 42.16,50.29 | 42.16,50.29 v40.39,50.29 | v29.21,50.29 12.45,50.29 9.91,52.83 9.91,114.3 16.51,120.9 33.53,120.9 36.07,123.44 36.07,134.11 53.34,151.38 83.82,151.38 86.43,148.78 IDC1.5
LED_CON_R  (via drill 0.35 pad 0.7)
  Top 0.254: v32,110.49 v32,127.51 | v56.39,85.09 56.13,85.34 v56.13,92.46
  Bottom 0.254: C12.1 53.08,80.77 R19.2 55.89,84.59 v56.39,85.09 | v32,110.49 39.24,110.49 41.78,107.95 41.78,95.12 42.93,93.98 54.61,93.98 v56.13,92.46 | v32,127.51 32,131.32 52.83,152.15 88.14,152.15 88.97,151.32 IDC1.3
MAIN_BRIGHT  (via drill 0.35 pad 0.7)
  Top 0.254: v83.82,140.21 v98.55,140.21
  Bottom 0.254: IDC1.8 83.89,140.27 v83.82,140.21 | v98.55,140.21 117.86,140.21 121.16,136.91 121.16,133.1 120.14,132.08 Q1.2
MOD_BREATH  (via drill 0.35 pad 0.7)
  Top 0.254: v53.09,29.21 v44.7,29.21 | v73.66,138.68 v81.28,138.68
  Bottom 0.254: U7.3 v53.09,29.21 | LED1.1 45.97,17.78 44.7,19.05 v44.7,29.21 37.59,29.21 35.31,31.5 35.31,56.39 37.34,58.42 37.34,77.98 33.78,81.53 33.78,91.95 31.75,93.98 17.02,93.98 15.75,95.25 15.75,101.09 17.78,103.12 U6.1 23.62,110.74 25.4,112.52 57.66,112.52 73.66,128.52 v73.66,138.68 | v81.28,138.68 81.28,144.71 IDC1.10
MOD_FAST3  (via drill 0.35 pad 0.7)
  Top 0.254: v55.63,29.21 v55.63,16 | v148.84,105.92 v102.11,105.92
  Bottom 0.254: U7.2 54.36,30.48 v55.63,29.21 | v55.63,16 60.2,16 LED2.1 62.23,6.35 63.88,4.7 89.15,4.7 94.87,10.41 107.95,10.41 115.06,17.53 119.38,17.53 128.52,26.67 128.52,45.47 131.06,48.01 146.3,48.01 148.84,50.55 v148.84,105.92 | IDC1.12 78.81,137.35 94.11,122.05 95.38,122.05 103.63,113.79 103.63,107.44 v102.11,105.92 99.06,105.92 U15.1 U15.2
MOD_FASTER  (via drill 0.35 pad 0.7)
  Top 0.254: v87.88,28.96 v58.93,28.96 | v138.43,115.82 138.34,115.91 92.55,115.91 v92.46,115.82
  Bottom 0.254: C20.1 43.43,31.75 45.47,33.78 51.82,33.78 | IDC1.14 76.27,138.62 92.46,122.43 v92.46,115.82 U15.9 U15.8 | LED3.1 91.69,13.97 87.88,17.78 v87.88,28.96 91.44,28.96 92.96,27.43 92.96,23.62 97.28,19.3 119.89,19.3 126.87,26.29 126.87,46.74 129.41,49.28 144.18,49.28 146.72,51.82 146.72,113.28 144.18,115.82 v138.43,115.82 | 51.82,33.78 57.4,33.78 58.93,32.26 v58.93,28.96 | U7.4 51.82,33.78
MOD_STATIC  (via drill 0.35 pad 0.7)
  Top 0.254: v68.83,19.3 91.19,19.3 v91.44,19.56 | v74.93,133.1 v74.93,115.32 | v64.01,55.12 v64.01,46.99
  Bottom 0.254: 59.69,27.43 64.01,31.75 v64.01,46.99 | 59.69,27.43 49.28,27.43 48.01,28.7 U7.7 | 59.69,27.43 59.69,21.84 62.23,19.3 v68.83,19.3 | v91.44,19.56 93.22,17.78 LED4.1 | IDC1.16 74.93,143.58 v74.93,133.1 | v74.93,115.32 63.88,104.27 D11.1 D10.1 D9.1 58.29,64.39 64.01,58.67 v64.01,55.12
MOD_SW  (via drill 0.35 pad 0.7)
  Top 0.254: v19.81,83.06 v25.65,83.06 | v36.07,73.15 v53.34,73.15
  Bottom 0.254: U7.14 53.09,40.89 56.9,44.7 56.9,69.6 v53.34,73.15 | IDC1.18 71.19,138.5 69.6,136.91 42.67,136.91 38.35,132.59 38.35,122.17 32.26,116.08 16.51,116.08 13.97,113.54 13.97,88.9 v19.81,83.06 | v25.65,83.06 30.23,83.06 36.07,77.22 v36.07,73.15
N$1
  Bottom 0.254: VR1.1 75.06,22.73 D1.1
N$2  (via drill 0.35 pad 0.7)
  Top 0.254: v65.53,41.15 v78.49,41.15
  Bottom 0.254: U1.7 74.93,41.15 | 74.93,41.15 R1.2 | VR1.2 80.06,21.79 77.72,24.13 68.07,24.13 65.53,26.67 v65.53,41.15 | v78.49,41.15 74.93,41.15
N$3
  Bottom 0.254: D2.2 80.01,37.34 81.03,38.35 90.93,38.35 92.96,36.32 92.96,34.29 90.17,31.5 87.38,31.5 85.06,29.18 VR1.3
N$4
  Bottom 0.254: C2.1 U1.5
N$5  (via drill 0.35 pad 0.7)
  Top 0.254: v70.87,36.83 v70.87,30.23
  Bottom 0.254: 74.8,28.7 D1.2 74.68,26.16 73.41,26.16 70.87,28.7 v70.87,30.23 | 74.8,28.7 74.8,31.62 U1.2 | 74.8,28.7 78.99,28.7 80.01,29.72 D2.1 83.57,31.75 84.84,33.02 84.84,35.56 85.6,36.32 C1.1 | U1.6 73.66,35.56 72.9,34.8 71.63,34.8 70.87,35.56 v70.87,36.83
N$6  (via drill 0.35 pad 0.7)
  Top 0.254: v100.08,96.27 v100.08,108.71 | v102.36,111 v129.29,111 | v68.83,42.67 v68.83,50.8
  Bottom 0.254: U1.3 73.66,33.02 73.15,33.53 70.87,33.53 68.83,35.56 v68.83,42.67 | v68.83,50.8 71.12,50.8 72.39,52.07 U2.10 72.39,65.79 71.37,66.8 61.72,66.8 59.18,69.34 59.18,82.55 60.96,84.33 60.96,101.85 61.98,102.87 63.75,102.87 64.77,101.85 64.77,99.06 66.04,97.79 79.76,97.79 81.28,96.27 v100.08,96.27 | v100.08,108.71 v102.36,111 | v129.29,111 133.1,111 134.62,112.52 134.62,122.68 127.76,129.54 R2.1
N$7
  Bottom 0.254: Q1.1 R2.2
N$8
  Bottom 0.254: U2.4 80.01,65.79 81.28,64.52 81.28,53.59 83.31,51.56 83.31,42.93 85.85,40.39 92.2,40.39 97.79,34.8 97.79,31.24 99.31,29.72 U3.1
N$9
  Bottom 0.254: U2.13 80.01,53.85 82.42,51.44 82.42,42.04 84.96,39.5 92.08,39.5 97.03,34.54 97.03,23.88 98.55,22.35 116.59,22.35 119.13,24.89 119.13,31.75 118.36,32.51 113.03,32.51 111.76,31.24 U3.5
N$10  (via drill 0.35 pad 0.7)
  Top 0.254: v121.16,40.13 v118.11,40.13
  Bottom 0.254: U2.12 77.47,54.61 81.53,50.55 81.53,41.4 84.07,38.86 91.44,38.86 94.74,35.56 94.74,24.38 97.79,21.34 118.62,21.34 121.16,23.88 v121.16,40.13 | U3.8 116.84,38.86 v118.11,40.13
N$11
  Bottom 0.254: U2.14 82.55,53.59 84.33,51.82 84.33,43.43 86.61,41.15 104.14,41.15 106.68,38.61 U3.12
N$12
  Bottom 0.254: U2.15 81.28,66.04 81.28,86.36 U4.1
N$14  (via drill 0.35 pad 0.7)
  Top 0.254: v106.68,26.16 v123.44,26.16
  Bottom 0.254: R3.1 124.97,27.69 v123.44,26.16 | U3.3 v106.68,26.16
N$15
  Bottom 0.254: U3.4 109.22,33.27 110.24,34.29 114.55,34.29 115.66,35.4 115.66,41.74 117.09,43.18 R5.1
N$16
  Bottom 0.254: R7.1 112.78,40.89 111.76,39.88 U3.10
N$17
  Bottom 0.254: R9.1 106.68,42.42 109.22,39.88 U3.11
N$18
  Bottom 0.254: R11.1 96.01,43.18 93.47,45.72 93.47,71.12 84.33,80.26 84.33,91.44 81.79,93.98 U4.3
N$19
  Bottom 0.254: R4.1 124.95,45.21 R3.2 R12.1
N$20
  Bottom 0.254: R6.1 118.89,45.21 | R5.2 118.89,45.21 | R4.2 118.89,45.21
N$21
  Bottom 0.254: R8.1 R6.2 112.79,45.21 R7.2
N$22
  Bottom 0.254: R10.1 106.69,45.21 | R8.2 108.46,45.21 106.69,45.21 | R9.2 106.69,45.21
N$23
  Bottom 0.254: R13.1 R10.2 100.34,45.21 R11.2
N$24
  Bottom 0.254: U5.3 102.62,83.82 101.09,85.34 95,85.34 92.46,82.8 C3.1 94.23,77.98 96.03,76.19 R13.2
N$25
  Bottom 0.254: U5.1 U5.2 R14.1
N$26  (via drill 0.35 pad 0.7)
  Top 0.254: v33.27,100.58 v62.74,100.58
  Bottom 0.254: R16.2 R15.2 | U5.7 112.78,85.85 114.3,87.38 114.3,90.68 113.54,91.44 106.93,91.44 106.52,91.02 106.52,88.99 105.68,88.15 R16.2 | R16.2 95.5,87.38 94.23,88.65 94.23,92.71 91.69,95.25 65.02,95.25 62.74,97.54 v62.74,100.58 | U6.2 24.89,101.09 25.4,100.58 v33.27,100.58
N$27
  Bottom 0.254: R15.1 U5.5 107.7,79.5 106.93,78.74 R14.2
N$28
  Bottom 0.254: R16.1 108.97,87.38 110.24,86.11 U5.6 C4.1
N$29
  Bottom 0.254: U6.3 26.16,106.93 27.18,107.95 38.1,107.95 40.64,105.41 D5.1 D3.1 D4.1
N$32
  Bottom 0.254: U7.10 48.01,35.05 48.77,34.29 53.85,34.29 54.36,34.8 U7.15
N$33
  Bottom 0.254: R18.1 LED1.2 64.77,17.78 | 64.77,17.78 67.82,17.78 70.36,15.24 70.36,8.13 72.64,5.84 89.15,5.84 94.49,11.18 97.79,11.18 | LED2.2 64.77,17.78 | LED4.2 110.49,15.49 106.17,11.18 97.79,11.18 | LED3.2 97.79,11.18
N$34
  Bottom 0.254: U6.5 28.7,105.16 29.46,105.92 36.58,105.92 37.85,104.65 37.85,91.95 38.86,90.93 41.66,90.93 43.43,89.15 43.43,86.74 U8.2
N$35
  Bottom 0.254: U8.12 44.58,82.93 43.94,83.57 42.42,83.57 36.83,89.15 36.83,103.63 35.05,105.41 30.73,105.41 29.97,104.65 U6.6
N$36  (via drill 0.35 pad 0.7)
  Top 0.254: v47.24,89.92 v47.24,92.46
  Bottom 0.254: U6.4 27.43,105.66 28.7,106.93 36.83,106.93 38.35,105.41 38.35,94.74 40.64,92.46 v47.24,92.46 | U8.5 47.12,89.79 v47.24,89.92
N$37
  Bottom 0.254: U8.1 42.04,85.22 42.67,84.58 47.75,84.58 48.51,83.82 | 48.51,83.82 48.51,81.75 U8.9 | 48.51,83.82 49.28,84.58 50.55,84.58 51.05,85.09 51.05,86.11 51.56,86.61 R19.1
N$38
  Bottom 0.254: R20.1 43.69,61.25 U9.5 43.56,63.37 42.93,64.01 40.64,64.01 40.13,64.52 40.13,75.44 43.18,78.49 43.18,81.5 U8.13
N$39  (via drill 0.35 pad 0.7)
  Top 0.254: v44.45,89.92 v44.45,76.71 | v61.98,76.2 v50.55,76.2
  Bottom 0.254: U8.3 44.58,89.79 v44.45,89.92 | v44.45,76.71 45.85,78.11 | 45.85,78.11 U8.11 | U3.6 114.3,26.67 111.76,24.13 106.68,24.13 104.14,26.67 U3.2 104.14,34.04 | 104.14,34.04 U3.13 | 104.14,34.04 106.68,34.04 107.95,35.31 | 107.95,35.31 113.79,35.31 114.3,35.81 U3.9 | 107.95,35.31 107.95,39.37 105.41,41.91 87.63,41.91 86.36,43.18 86.36,66.29 87.63,67.56 U2.1 82.55,74.93 82.55,87.63 U4.2 75.69,91.44 74.42,90.17 74.42,78.74 71.88,76.2 v61.98,76.2 | U9.3 46.1,63.37 46.48,63.75 51.56,63.75 54.1,66.29 54.1,69.6 50.55,73.15 v50.55,76.2 48.64,78.11 45.85,78.11
N$40
  Bottom 0.254: U9.1 48.64,55.75 50.04,54.36 R21.1
N$58
  Bottom 0.254: R35.2 19.3,61.23 | 19.3,61.23 19.3,62.74 | 19.3,62.74 U10.6 | C17.1 19.29,61.21 19.3,61.23 | 19.3,62.74 22.86,62.74 24.38,64.26 24.38,65.53 24.38,66.8 U10.2
N$59
  Bottom 0.254: R35.1 24.12,60.96 R34.2 24.13,62.48 25.65,64.01 U10.1
N$60  (via drill 0.35 pad 0.7)
  Top 0.254: v20.57,64.26 v20.57,48.01 | v150.88,97.28 150.62,97.03 v136.4,97.03
  Bottom 0.254: U10.5 v20.57,64.26 | v20.57,48.01 20.57,41.15 55.63,6.1 59.44,6.1 61.85,3.68 98.21,3.68 106.14,5.81 115.7,15.37 120.02,15.37 130.3,25.65 130.3,43.69 132.84,46.23 148.34,46.23 150.88,48.77 v150.88,97.28 | v136.4,97.03 U11.14
N$61
  Bottom 0.254: U10.3 23.11,68.83 22.61,69.34 15.75,69.34 15.24,68.83 C19.1
N$62
  Bottom 0.254: U13.5 81.53,115.82 81.28,115.57 79.5,115.57 78.99,116.08 U13.7
N$63  (via drill 0.35 pad 0.7)
  Top 0.254: v87.12,110.49 v87.12,99.31 | v107.44,93.47 v126.75,93.47
  Bottom 0.254: U13.2 85.34,112.27 v87.12,110.49 | v87.12,99.31 101.6,99.31 v107.44,93.47 | v126.75,93.47 126.75,95.76 129.29,98.3 131.32,98.3 133.86,95.76 U11.12
N$64  (via drill 0.35 pad 0.7)
  Top 0.254: v126.49,101.85 v101.6,101.85
  Bottom 0.254: U11.15 137.67,99.31 135.13,101.85 v126.49,101.85 | v101.6,101.85 97.54,101.85 96.27,103.12 U15.3
N$65
  Bottom 0.254: U15.5 93.73,107.95 92.96,108.71 85.6,108.71 84.07,110.24 U13.3
N$66  (via drill 0.35 pad 0.7)
  Top 0.254: v82.8,104.39 v82.8,108.97
  Bottom 0.254: U15.6 92.46,102.62 91.19,101.35 85.85,101.35 v82.8,104.39 | v82.8,108.97 U13.4
N$67
  Bottom 0.254: U16.1 127.76,64.26 130.3,66.8 138.43,66.8 139.19,67.56 139.19,78.74 137.67,80.26 U11.2
N$68  (via drill 0.35 pad 0.7)
  Top 0.254: v135.13,80.77 v145.54,80.77
  Bottom 0.254: U11.4 v135.13,80.77 | v145.54,80.77 145.54,59.18 144.53,58.17 138.94,58.17 137.92,59.18 U16.5
N$69
  Bottom 0.254: U11.7 131.32,89.92 132.08,90.68 139.7,90.68 143,87.38 U16.8
N$70  (via drill 0.35 pad 0.7)
  Top 0.254: v115.57,59.18 v130.3,59.18
  Bottom 0.254: 140.46,65.79 132.84,65.79 130.3,63.25 U16.2 v130.3,59.18 | U16.9 140.46,65.79 | 140.46,65.79 U16.6 | U15.4 95,102.11 96.52,100.58 103.63,100.58 109.98,94.23 113.54,94.23 115.57,92.2 v115.57,59.18
N$71
  Bottom 0.254: U16.3 D6.1
N$72
  Bottom 0.254: D7.1 U16.4
N$73
  Bottom 0.254: D8.1 U16.10
N$74
  Bottom 0.254: U10.13 24.38,74.68 25.15,75.44 29.97,75.44 30.99,74.42 R37.1 28.97,69.61 R36.2
N$75
  Bottom 0.254: U10.8 18.03,70.61 18.8,69.85 22.61,69.85 23.11,70.36 | 23.11,70.36 U10.12 | 27.94,67.56 C18.1 | 23.11,70.36 25.15,70.36 27.94,67.56 | 27.94,67.56 30.48,67.56 30.99,68.07 R37.2
N$76  (via drill 0.35 pad 0.7)
  Top 0.254: v35.31,103.38 v35.31,114.81 | v38.1,38.1 v38.1,33.78
  Bottom 0.254: v38.1,38.1 38.1,56.64 38.61,57.15 38.61,78.49 35.31,81.79 v35.31,103.38 | v35.31,114.81 41.66,114.81 43.69,116.84 43.69,119.93 U14.1 | v38.1,33.78 42.15,33.78 C20.2 R48.1
N$77  (via drill 0.35 pad 0.7)
  Top 0.254: v28.96,117.86 v28.96,126.24
  Bottom 0.254: v28.96,126.24 28.96,130.56 51.56,153.16 106.43,153.16 135.89,123.7 135.89,111 133.35,108.46 122.43,108.46 121.41,109.47 U12.14 | v28.96,117.86 16.51,117.86 12.45,113.79 12.45,77.72 15.49,74.68 18.03,74.68 19.3,73.41 U10.9
N$78
  Bottom 0.254: D13.2 D12.2 | D13.2 U12.15 D13.2 | D13.2
N$79
  Bottom 0.254: U14.6 56.35,122.64 57.15,123.44 62.23,123.44 64.01,125.22 64.01,130.09 R39.1
N$80  (via drill 0.35 pad 0.7)
  Top 0.254: v95,118.11 v107.7,118.11
  Bottom 0.254: U15.10 93.73,116.84 v95,118.11 | v107.7,118.11 112.78,118.11 114.3,119.63 D12.1
N$81
  Bottom 0.254: U12.2 122.68,104.39 123.7,103.38 D14.1
N$82
  Bottom 0.254: D15.1 119.89,103.38 120.14,103.63 U12.4
N$83
  Bottom 0.254: D16.1 116.08,103.63 116.33,103.89 U12.7
N$84
  Bottom 0.254: R38.1 C25.1 D13.1
N$85
  Bottom 0.254: U13.15 85.34,126.24 84.84,126.75 83.31,126.75 82.8,126.24 U13.13
N$86  (via drill 0.35 pad 0.7)
  Top 0.254: v76.11,123.7 v99.57,123.7
  Bottom 0.254: R38.2 131.83,117.87 131.83,122.17 130.3,123.7 120.65,123.7 | U12.10 116.33,115.82 117.6,117.09 119.63,117.09 120.65,118.11 120.65,123.7 | U13.9 v76.11,123.7 | v99.57,123.7 120.65,123.7
N$87
  Bottom 0.254: R41.1 U14.11
N$88
  Bottom 0.254: U14.14 R43.1 | R43.1
N$89  (via drill 0.35 pad 0.7)
  Top 0.254: v57.4,116.08 v71.88,116.08
  Bottom 0.254: U14.15 46.19,126.07 47.37,124.89 47.37,115.95 49.28,114.05 55.37,114.05 v57.4,116.08 | v71.88,116.08 76.71,120.9 80.52,120.9 81.53,121.92 U13.12
N$90
  Bottom 0.254: R45.1 41.11,126.53 42.42,125.22 45.21,125.22 46.19,124.25 U14.2
N$91
  Bottom 0.254: R40.1 R46.1 63.98,132.16 R39.2
N$92
  Bottom 0.254: R42.1 R40.2 56.36,132.16 R41.2 | R42.1
N$93
  Bottom 0.254: R44.1 48.74,132.16 | R42.2 51.31,132.16 48.74,132.16 | R42.2 | R43.2 48.74,132.16

### Text on the board
Bottom: Designed by JsKim